# EAGLE design DM542T (EAGLE 9.1.3)
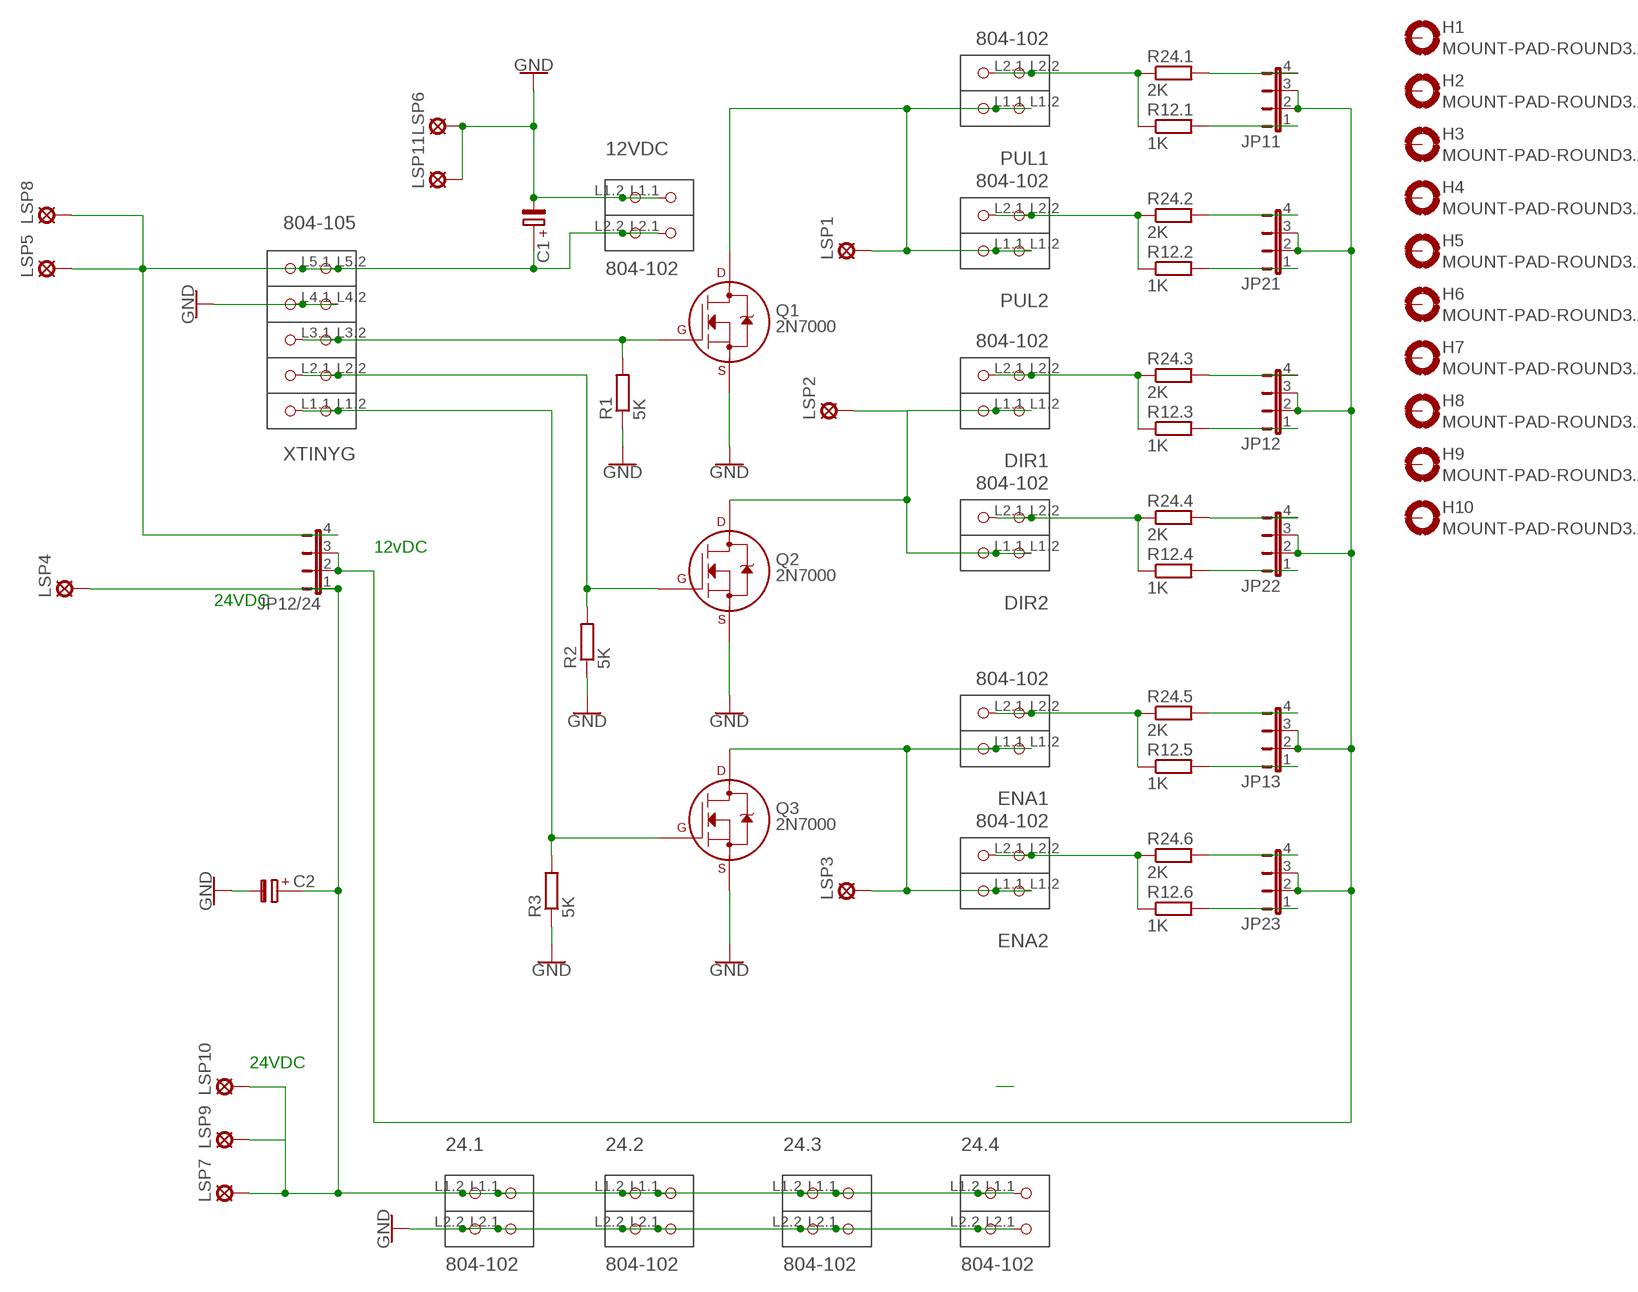
[diagram p0: schematic, sheet 1]

## Parts
12VDC  804-102  [P-804-102]
24.1  804-102  [P-804-102]
24.2  804-102  [P-804-102]
24.3  804-102  [P-804-102]
24.4  804-102  [P-804-102]
C1  C-PR-3,5X10  [E3,5-10]
C2  C-PR-3,5X10  [E3,5-10]
DIR1  804-102  [P-804-102]
DIR2  804-102  [P-804-102]
ENA1  804-102  [P-804-102]
ENA2  804-102  [P-804-102]
H1  MOUNT-PAD-ROUND3.2  [3,2-PAD]
H2  MOUNT-PAD-ROUND3.2  [3,2-PAD]
H3  MOUNT-PAD-ROUND3.2  [3,2-PAD]
H4  MOUNT-PAD-ROUND3.2  [3,2-PAD]
H5  MOUNT-PAD-ROUND3.2  [3,2-PAD]
H6  MOUNT-PAD-ROUND3.2  [3,2-PAD]
H7  MOUNT-PAD-ROUND3.2  [3,2-PAD]
H8  MOUNT-PAD-ROUND3.2  [3,2-PAD]
H9  MOUNT-PAD-ROUND3.2  [3,2-PAD]
H10  MOUNT-PAD-ROUND3.2  [3,2-PAD]
JP11  JP4E  [JP4]
JP12  JP4E  [JP4]
JP12/24  JP4E  [JP4]
JP13  JP4E  [JP4]
JP21  JP4E  [JP4]
JP22  JP4E  [JP4]
JP23  JP4E  [JP4]
LSP1  LSP10  [LSP10]
LSP2  LSP10  [LSP10]
LSP3  LSP10  [LSP10]
LSP4  LSP10  [LSP10]
LSP5  LSP10  [LSP10]
LSP6  LSP10  [LSP10]
LSP7  LSP10  [LSP10]
LSP8  LSP10  [LSP10]
LSP9  LSP10  [LSP10]
LSP10  LSP10  [LSP10]
LSP11  LSP10  [LSP10]
PUL1  804-102  [P-804-102]
PUL2  804-102  [P-804-102]
Q1  2N7000  2N7000_TO92  [TO-92]
Q2  2N7000  2N7000_TO92  [TO-92]
Q3  2N7000  2N7000_TO92  [TO-92]
R1  5K  R-EU_0207/15  [0207/15]
R2  5K  R-EU_0207/15  [0207/15]
R3  5K  R-EU_0207/15  [0207/15]
R12.1  1K  R-EU_0207/15  [0207/15]
R12.2  1K  R-EU_0207/15  [0207/15]
R12.3  1K  R-EU_0207/15  [0207/15]
R12.4  1K  R-EU_0207/15  [0207/15]
R12.5  1K  R-EU_0207/15  [0207/15]
R12.6  1K  R-EU_0207/15  [0207/15]
R24.1  2K  R-EU_0207/15  [0207/15]
R24.2  2K  R-EU_0207/15  [0207/15]
R24.3  2K  R-EU_0207/15  [0207/15]
R24.4  2K  R-EU_0207/15  [0207/15]
R24.5  2K  R-EU_0207/15  [0207/15]
R24.6  2K  R-EU_0207/15  [0207/15]
XTINYG  804-105  [P-804-105]

## Nets
GND: 12VDC.L1.1(P1.1) 12VDC.L1.2(P1.2) 24.1.L2.1(P2.1) 24.1.L2.2(P2.2) 24.2.L2.1(P2.1) 24.2.L2.2(P2.2) 24.3.L2.1(P2.1) 24.3.L2.2(P2.2) 24.4.L2.1(P2.1) 24.4.L2.2(P2.2) C1.- C2.- LSP6.MP LSP11.MP Q1.1(S) Q2.1(S) Q3.1(S) R1.1 R2.1 R3.1 XTINYG.L4.1(P4.1) XTINYG.L4.2(P4.2)
N$1: PUL1.L2.1(P2.1) PUL1.L2.2(P2.2) R12.1.1 R24.1.1
N$2: 12VDC.L2.1(P2.1) 12VDC.L2.2(P2.2) C1.+ JP12/24.4 LSP5.MP LSP8.MP XTINYG.L5.1(P5.1) XTINYG.L5.2(P5.2)
N$4: Q2.2(G) R2.2 XTINYG.L2.1(P2.1) XTINYG.L2.2(P2.2)
N$5: Q3.2(G) R3.2 XTINYG.L1.1(P1.1) XTINYG.L1.2(P1.2)
N$6: DIR1.L1.1(P1.1) DIR1.L1.2(P1.2) DIR2.L1.1(P1.1) DIR2.L1.2(P1.2) LSP2.MP Q2.3(D)
N$7: 24.1.L1.1(P1.1) 24.1.L1.2(P1.2) 24.2.L1.1(P1.1) 24.2.L1.2(P1.2) 24.3.L1.1(P1.1) 24.3.L1.2(P1.2) 24.4.L1.1(P1.1) 24.4.L1.2(P1.2) C2.+ JP12/24.1 LSP4.MP LSP7.MP LSP9.MP LSP10.MP
N$8: JP11.4 R24.1.2
N$9: LSP1.MP PUL1.L1.1(P1.1) PUL1.L1.2(P1.2) PUL2.L1.1(P1.1) PUL2.L1.2(P1.2) Q1.3(D)
N$10: PUL2.L2.1(P2.1) PUL2.L2.2(P2.2) R12.2.1 R24.2.1
N$11: JP11.1 R12.1.2
N$12: JP13.4 R24.5.2
N$13: JP12.1 R12.3.2
N$14: JP22.4 R24.4.2
N$15: JP13.1 R12.5.2
N$16: DIR1.L2.1(P2.1) DIR1.L2.2(P2.2) R12.3.1 R24.3.1
N$17: JP11.2 JP11.3 JP12.2 JP12.3 JP12/24.2 JP12/24.3 JP13.2 JP13.3 JP21.2 JP21.3 JP22.2 JP22.3 JP23.2 JP23.3
N$18: JP12.4 R24.3.2
N$19: ENA1.L2.1(P2.1) ENA1.L2.2(P2.2) R12.5.1 R24.5.1
N$20: JP21.1 R12.2.2
N$21: JP23.4 R24.6.2
N$22: JP23.1 R12.6.2
N$23: ENA2.L2.1(P2.1) ENA2.L2.2(P2.2) R12.6.1 R24.6.1
N$24: JP21.4 R24.2.2
N$25: ENA1.L1.1(P1.1) ENA1.L1.2(P1.2) ENA2.L1.1(P1.1) ENA2.L1.2(P1.2) LSP3.MP Q3.3(D)
N$26: DIR2.L2.1(P2.1) DIR2.L2.2(P2.2) R12.4.1 R24.4.1
N$28: JP22.1 R12.4.2
N$30: Q1.2(G) R1.2 XTINYG.L3.1(P3.1) XTINYG.L3.2(P3.2)
Unconnected: H1.B3,2(MOUNT) H2.B3,2(MOUNT) H3.B3,2(MOUNT) H4.B3,2(MOUNT) H5.B3,2(MOUNT) H6.B3,2(MOUNT) H7.B3,2(MOUNT) H8.B3,2(MOUNT) H9.B3,2(MOUNT) H10.B3,2(MOUNT)

## Notes on the sheet
- 12vDC
- 24VDC
- 24VDC

## Library data of the parts
12VDC 24.1-24.4 DIR1 DIR2 ENA1 ENA2 PUL1 PUL2 = con-wago_804:804-102: Serie 804, 1-Leiter-Klemmenleiste für Leiterplatten 2 Lötstifte/Pol versetzt / Series 804, 1-conductor PCB terminal strip 2 solder pins/pole, staggered Polzahl / Pole No.: 2 Rastermaß / Pitch: 5 - 5 mm Bemessungsspannung / Rated Voltage: 320 V Nennstrom / Nominal Current: 24 A Leiterquerschnitt / Conductor Size: 0.25 - 2.5 mm2 Anschlusstechnik / Connection Technology: CAGE CLAMP® S Lötstiftlänge: / Solder Pin Length: 3.6 mm Leitereinführung (zur Platine) / Conductor entry angle (to PCB): 0 ° Farbe / Color: grau / gray Stand: 01.01.2014. Die jeweils aktuellen Daten zu diesem Artikel finden Sie in unserem Produktkatalog, den Sie unter www.wago.com einsehen können. As of: 01/01/2014. Please find the newest data for this article in our product catalogue, which can be viewed under www.wago.com.
C1 C2 = cap-pan40:C-PR: POLARIZED ELECTROLYTIC/TANTALUM
H1-H10 = holes:MOUNT-PAD-ROUND: MOUNTING PAD, round
JP11 JP12 JP12/24 JP13 JP21-JP23 = jumper:JP4E: JUMPER
LSP1-LSP11 = solpad:LSP10: SOLDER PAD drill 1.0 mm, distributor Buerklin, 12H555
Q1-Q3 = transistors:2N700*: 2N7000, 2N7002, NDS7002A N-channel enhancement mode MOSFET
R1-R3 R12.1-R12.6 R24.1-R24.6 = rcl:R-EU_: RESISTOR, European symbol; SPICEPREFIX: R
XTINYG = con-wago_804:804-105: Serie 804, 1-Leiter-Klemmenleiste für Leiterplatten 2 Lötstifte/Pol versetzt / Series 804, 1-conductor PCB terminal strip 2 solder pins/pole, staggered Polzahl / Pole No.: 5 Rastermaß / Pitch: 5 - 5 mm Bemessungsspannung / Rated Voltage: 320 V Nennstrom / Nominal Current: 24 A Leiterquerschnitt / Conductor Size: 0.25 - 2.5 mm2 Anschlusstechnik / Connection Technology: CAGE CLAMP® S Lötstiftlänge: / Solder Pin Length: 3.6 mm Leitereinführung (zur Platine) / Conductor entry angle (to PCB): 0 ° Farbe / Color: grau / gray Stand: 01.01.2014. Die jeweils aktuellen Daten zu diesem Artikel finden Sie in unserem Produktkatalog, den Sie unter www.wago.com einsehen können. As of: 01/01/2014. Please find the newest data for this article in our product catalogue, which can be viewed under www.wago.com.

## Board
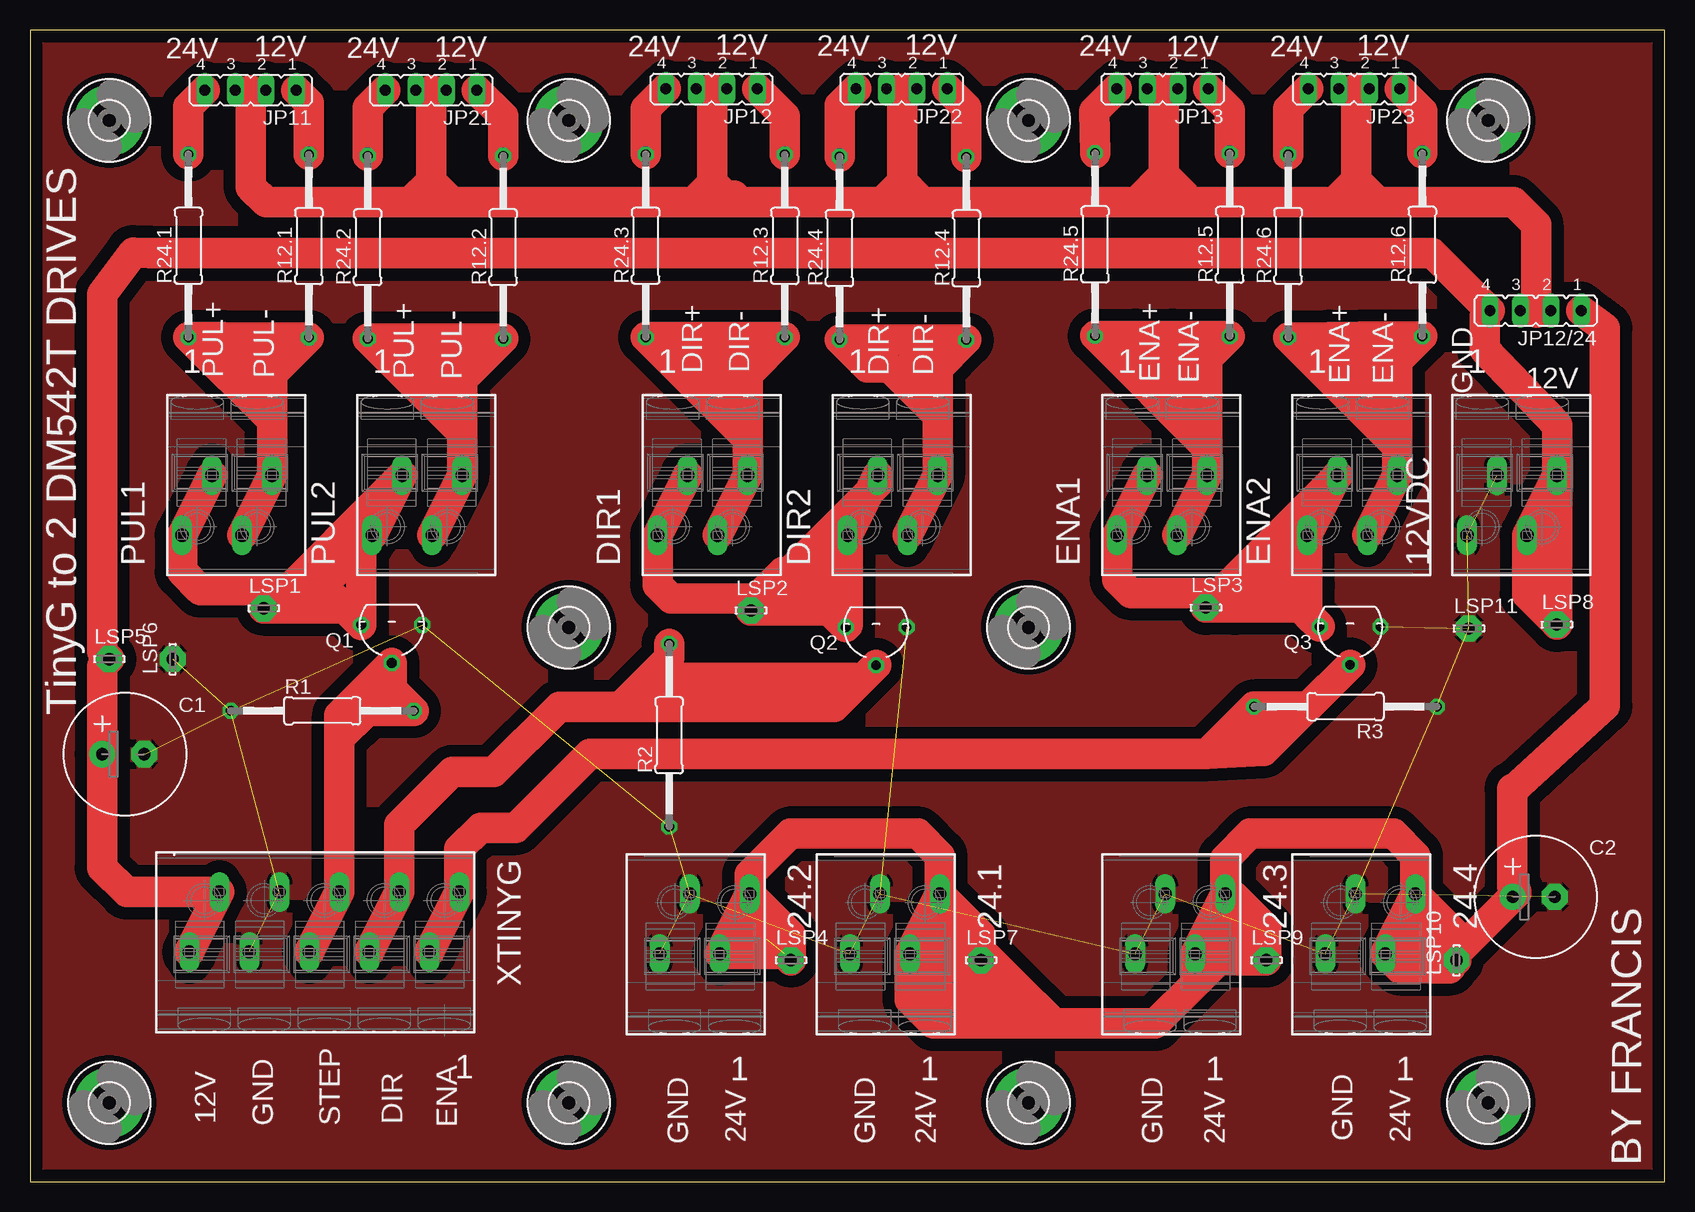
[diagram p1: board, top side]

Size 136.23 x 96.04 mm. Coordinates in mm from the lower left corner, seen from the top.
Outline: 0,0 136.23,0 136.23,96.04 0,96.04 0,0
Copper layers (1*16): Top 0.35mm / dielectric 1.5mm / Bottom 0.35mm
Design rules "default *": minimum track width 0.35mm, minimum drill 0.35mm, track to track 0.35mm, track to pad 0.35mm, pad to pad 0.35mm, via to via 0.35mm, smd to smd 6mil, copper to edge 40mil, drill to drill 0.35mm, minimum pad ring 10mil, minimum via ring 8mil, stop-mask expansion 4mil, vias tented up to drill 0mil, thermal gap 10mil

### Footprints (pad centres in the part's own frame; a part is rotated, then mirrored left to right if it is on the bottom)
P-804-102 = drill 1.1 long: L1.1 0.8,2; L1.2 -4.2,4.5; L2.1 0.8,-3; L2.2 -4.2,-0.5
E3,5-10 = drill 1.016 pad 2.184: + -1.905,0 | drill 1.016 pad 2.184 octagon: - 1.587,0
3,2-PAD = drill 3.2 pad 5.842: B3,2 0,0
JP4 = drill 0.914 long: 1 -3.81,0; 2 -1.27,0; 3 1.27,0; 4 3.81,0
LSP10 = drill 1.016 pad 2.159 octagon: MP 0,0
TO-92 = drill 0.813 octagon: 1 -2.54,0; 2 0,3.175; 3 2.54,0
0207/15 = drill 0.813 octagon: 1 -7.62,0; 2 7.62,0
P-804-105 = drill 1.1 long: L1.1 0.637,9.5; L1.2 -4.363,12; L2.1 0.637,4.5; L2.2 -4.363,7; L3.1 0.637,-0.5; L3.2 -4.363,2; L4.1 0.637,-5.5; L4.2 -4.363,-3; L5.1 0.637,-10.5; L5.2 -4.363,-8

### Placement (x,y rotation side)
12VDC  124.26,58.12 90 top
24.1  71.32,19.81 270 top
24.2  55.47,19.81 270 top
24.3  95.1,19.81 270 top
24.4  110.95,19.81 270 top
C1  7.92,35.66 0 top
C2  125.48,23.77 0 top
DIR1  56.79,58.12 90 top
DIR2  72.64,58.12 90 top
ENA1  95.1,58.12 90 top
ENA2  110.95,58.12 90 top
H1  6.6,88.49 0 top
H2  44.91,88.49 0 top
H3  6.6,6.6 0 top
H4  44.91,6.6 0 top
H5  83.21,6.6 180 top
H6  121.51,6.6 0 top
H7  83.21,88.49 0 top
H8  121.51,88.49 0 top
H9  44.91,46.23 0 top
H10  83.21,46.23 0 top
JP11  18.39,91.03 180 top
JP12  56.79,91.14 180 top
JP12/24  125.48,72.64 180 top
JP13  94.39,91.14 180 top
JP21  33.43,91.03 180 top
JP22  72.64,91.14 180 top
JP23  110.34,91.14 180 top
LSP1  19.48,47.82 0 top
LSP2  60.08,47.64 0 top
LSP3  97.99,47.88 0 top
LSP4  63.4,18.49 0 top
LSP5  6.6,43.59 0 top
LSP6  11.89,43.59 90 top
LSP7  79.25,18.49 0 top
LSP8  127.23,46.47 0 top
LSP9  103.02,18.49 0 top
LSP10  118.87,18.49 90 top
LSP11  119.9,46.14 0 top
PUL1  17.17,58.12 90 top
PUL2  33.02,58.12 90 top
Q1  30.15,46.44 180 top
Q2  70.51,46.26 180 top
Q3  110.01,46.3 180 top
R1  24.36,39.28 0 top
R2  53.27,37.24 90 top
R3  109.63,39.62 180 top
R12.1  23.24,78.03 90 top
R12.2  39.43,77.93 90 top
R12.3  62.9,78.03 90 top
R12.4  78.03,77.83 90 top
R12.5  99.98,78.13 90 top
R12.6  116.03,78.13 90 top
R24.1  13.21,78.04 90 top
R24.2  28.14,77.93 90 top
R24.3  51.31,78.04 90 top
R24.4  67.46,77.85 90 top
R24.5  88.75,78.16 90 top
R24.6  104.85,78.03 90 top
XTINYG  23.77,19.81 270 top

### Tracks (layer width: path | path; a pad name or v marks a point on that pad's centre or on a via)
GND  (21 unrouted)
  pour Top (isolate 1.016): 0,96.42 0,0 136.04,0 136.04,96.42
N$1
  Top 2.54: PUL1.L2.1 PUL1.L2.2 | PUL1.L2.1 20.17,66.4 | 20.17,66.4 20.17,69.34 R12.1.1 | 16.12,70.42 R24.1.1 20.17,63.46 PUL1.L2.1 | 16.12,70.42 R12.1.1 | 16.12,70.42 20.14,66.4 20.17,66.4 | R12.1.1 20.17,67.33 PUL1.L2.1
N$2
  Top 2.54: 12VDC.L2.1 12VDC.L2.2 | 12VDC.L2.1 127.28,63.08 121.22,69.39 121.22,72.19 JP12/24.4 116.87,77.44 9.99,77.44 8.6,77.48 6,74.02 6,44.19 LSP5.MP 6.02,43 C1.+ 6.02,26.2 8.04,24.18 XTINYG.L5.2 XTINYG.L5.1 | 12VDC.L2.1 127.25,46.49 | 127.25,46.49 LSP8.MP 127.23,51.44 12VDC.L2.2 | 12VDC.L2.2 124.75,48.99 127.25,46.49
N$4
  Top 2.54: XTINYG.L2.1 XTINYG.L2.2 30.77,29.76 35.19,34.17 38.66,34.17 44.09,39.6 49.18,39.6 | 69.12,41.69 67.03,39.6 49.18,39.6 | 69.12,41.69 Q2.2 | R2.2 53.27,43.68 51.59,42.01 | 51.59,42.01 49.18,39.6 | 51.59,42.01 66.35,42.01 68.81,42.01 69.12,41.69
N$5
  Top 2.54: XTINYG.L1.1 XTINYG.L1.2 35.77,27.76 37.54,29.53 40.49,29.53 46.65,35.69 98.07,35.69 | 103.35,39.62 106.51,39.62 Q3.2 102.83,35.94 98.07,35.69 | 103.35,39.62 R3.2 99.52,37.13 | 98.07,35.69 99.52,37.13 | 99.52,37.13 100.86,37.13 103.35,39.62
N$6
  Top 2.54: DIR1.L1.1 DIR1.L1.2 52.29,49.77 53.43,48.64 60.52,48.64 | DIR2.L1.2 DIR2.L1.1 70.64,58.2 LSP2.MP | 60.52,48.64 62.74,50.86 63.02,50.58 | LSP2.MP 63.02,50.58 | DIR2.L1.2 61.87,47.64 LSP2.MP | 60.52,48.64 65.59,48.64 | 65.59,48.64 Q2.3 | Q2.3 66.58,47.64 LSP2.MP | DIR2.L1.2 68.14,46.43 Q2.3 | 65.59,48.64 66.69,49.74 66.69,51.15 65.75,50.21 65.44,50.21 64.73,49.5 63.32,49.5 63.32,50.28 63.02,50.58
N$7  (2 unrouted)
  Top 2.54: 24.2.L1.2 24.2.L1.1 62.88,19.01 LSP4.MP 63.4,20.59 24.2.L1.2 | 24.1.L1.2 74.53,21.43 | 74.53,21.43 24.1.L1.1 | 24.3.L1.2 98.59,22 | 98.59,22 24.3.L1.1 | 24.4.L1.2 114.1,21.32 | 114.1,21.32 24.4.L1.1 | LSP10.MP 118.87,20.59 117.7,21.76 | 117.7,21.76 24.4.L1.2 | LSP9.MP 103.02,21.13 100.38,23.77 99.83,23.77 24.3.L1.2 | LSP7.MP 79.25,19.3 | 24.1.L1.2 79.25,20.59 79.25,19.3 | 24.2.L1.2 59.97,25.63 63.4,29.06 73.97,29.06 75.82,27.2 24.1.L1.2 | 24.1.L1.1 73.32,15.17 75.29,13.21 84.53,13.21 | 85.34,13.21 93.78,13.21 97.1,16.53 | 97.1,16.53 24.3.L1.1 | 24.3.L1.2 99.6,26.95 101.7,29.06 113.59,29.06 115.45,27.2 24.4.L1.2 | 60.81,20.31 60.81,23.18 24.2.L1.2 | 24.1.L1.1 78.73,19.01 LSP7.MP | 74.53,21.43 75.92,21.43 76.52,20.83 | 76.69,20.67 76.52,20.83 | 76.52,20.83 76.52,20.96 | 24.3.L1.1 102.5,19.01 LSP9.MP | 98.59,22 98.74,22 100.59,20.14 | LSP10.MP 118.35,19.01 118.35,17.84 118.33,17.82 114.14,17.82 24.4.L1.1 | 114.1,21.32 115.67,21.32 116.73,20.26 | LSP10.MP 118.87,19.07 C2.+ 123.87,24.07 123.87,24.23 123.52,24.58 123.52,32.78 123.7,32.78 131.23,39.67 131.23,71.17 JP12/24.1 | LSP7.MP 84.53,13.21 | 84.53,13.21 85.34,13.21 | 85.34,13.21 81.88,16.66 | 81.88,16.66 79.25,19.3 | 24.1.L1.1 75.41,16.93 75.41,15.46 75.97,14.89 80.85,14.89 78.39,17.36 76.97,17.36 76.83,17.22 77.39,16.66 81.88,16.66 | LSP9.MP 99.06,18.49 97.1,16.53 | 24.4.L1.1 113.57,19.63 115.69,19.63 117.7,21.64 117.7,21.76
N$8
  Top 2.54: JP11.4 13.21,89.66 R24.1.2
N$9
  Top 2.54: PUL1.L1.1 PUL1.L1.2 12.67,50.88 14.2,49.34 21,49.34 | PUL2.L1.2 PUL2.L1.1 19.93,47.82 LSP1.MP | 21,49.34 21.61,49.34 24.71,49.34 Q1.3 | LSP1.MP 21,49.34 | LSP1.MP 22.43,47.82 PUL2.L1.2 | PUL2.L1.2 27.61,53 Q1.3 | Q1.3 26.23,47.82 LSP1.MP
N$10
  Top 2.54: PUL2.L2.1 PUL2.L2.2 | 31.5,70.31 R24.2.1 36.02,62.43 PUL2.L2.1 | 31.5,70.31 34.54,70.31 | 34.54,70.31 R12.2.1 | PUL2.L2.1 36.02,65.9 | 36.02,65.9 36.02,68.83 | 36.02,68.83 36.02,69.34 R12.2.1 | 31.5,70.31 35.91,65.9 36.02,65.9 | 34.54,70.31 36.02,68.83 | R12.2.1 36.02,66.89 PUL2.L2.1
N$11
  Top 2.54: JP11.1 23.24,89.99 R12.1.2
N$12
  Top 2.54: R24.5.2 88.69,89.25 JP13.4
N$13
  Top 2.54: JP12.1 62.9,88.84 R12.3.2
N$14
  Top 2.54: R24.4.2 67.46,89.76 JP22.4
N$15
  Top 2.54: JP13.1 99.98,89.36 R12.5.2
N$16
  Top 2.54: DIR1.L2.1 DIR1.L2.2 | 54.53,70.42 R24.3.1 59.79,61.94 DIR1.L2.1 | 54.53,70.42 58.13,70.42 | 58.13,70.42 R12.3.1 | DIR1.L2.1 59.79,65.16 | 59.79,65.16 59.79,68.06 | 59.79,68.06 59.79,69.34 R12.3.1 | 54.53,70.42 59.79,65.16 | 58.13,70.42 58.34,70.21 58.34,69.51 59.79,68.06 | R12.3.1 59.79,67.3 DIR1.L2.1
N$17
  Top 1.27: JP22.3 72.68,91.14 JP22.2 | JP13.3 94.5,91.14 JP13.2 | JP23.3 110.53,91.14 JP23.2 | JP12.3 56.85,91.14 JP12.2 | JP11.3 18.41,91.03 JP11.2 | JP21.3 33.43,91.03 JP21.2 | 125.57,72.47 125.74,72.64 JP12/24.2 JP12/24.3
  Top 2.54: 18.41,91.03 18.41,82.95 19.69,81.68 31.66,81.68 | 31.66,81.68 33.02,81.68 | 33.02,81.68 35.06,81.68 | 35.06,81.68 55.28,81.68 | 55.28,81.68 56.91,81.68 | 56.91,81.68 59.24,81.68 | 59.24,81.68 70.97,81.68 | 70.97,81.68 72.68,81.68 | 72.68,81.68 74.03,81.68 | 74.03,81.68 92.22,81.68 | 92.22,81.68 94.16,81.68 | 94.16,81.68 96.16,81.68 | 96.16,81.68 108.7,81.68 | 108.7,81.68 110.83,81.68 | 110.83,81.68 112.37,81.68 | 112.37,81.68 123.64,81.68 125.51,79.81 125.51,72.53 125.57,72.47 | 110.53,91.14 110.53,83.51 | 110.53,83.51 110.53,81.97 110.83,81.68 | 94.5,91.14 94.5,84 | 94.5,84 94.5,82.02 94.16,81.68 | 72.68,91.14 72.68,83.38 | 72.68,83.38 72.68,81.68 | 56.85,91.14 56.85,83.34 | 56.85,83.25 56.85,81.73 56.91,81.68 | 33.43,91.03 33.43,83.44 | 33.43,83.44 33.43,82.09 33.02,81.68 | 33.43,83.44 31.66,81.68 | 33.43,83.44 35.06,81.81 35.06,81.68 | 56.85,83.34 56.85,83.25 | 56.85,83.25 55.28,81.68 | 56.85,83.34 57.98,82.21 58.7,82.21 59.24,81.68 | 72.68,83.38 70.97,81.68 | 72.68,83.38 74.03,82.03 74.03,81.68 | 94.5,84 92.22,81.72 92.22,81.68 | 94.5,84 96.16,82.33 96.16,81.68 | 110.53,83.51 108.7,81.68 | 110.53,83.51 112.37,81.68
N$18
  Top 2.54: R24.3.2 51.31,89.46 JP12.4
N$19
  Top 2.54: ENA1.L2.1 ENA1.L2.2 | 92.11,70.53 R24.5.1 98.1,61.2 ENA1.L2.1 | 92.11,70.53 95.22,70.52 | 95.22,70.52 R12.5.1 | R12.5.1 98.1,69.34 98.1,67.95 | 98.1,67.95 98.1,64.77 | 98.1,64.77 ENA1.L2.1 | 92.11,70.53 97.87,64.77 98.1,64.77 | 95.22,70.52 97.79,67.95 98.1,67.95 | R12.5.1 98.1,68.63 ENA1.L2.1 | 91.98,70.28 97.74,64.52
N$20
  Top 2.54: JP21.1 39.43,88.84 R12.2.2
N$21
  Top 2.54: R24.6.2 104.85,89.46 JP23.4
N$22
  Top 2.54: JP23.1 116.03,89.25 R12.6.2
N$23
  Top 2.54: ENA2.L2.1 ENA2.L2.2 | 108.28,70.44 R24.6.1 108.08,67.18 | 108.28,70.44 110.9,70.46 | 110.9,70.46 R12.6.1 | R12.6.1 113.95,69.34 113.95,65.13 | 113.95,65.13 ENA2.L2.1 | 108.08,67.18 113.95,61.31 ENA2.L2.1 | 108.28,70.44 113.59,65.13 113.95,65.13 | 110.9,70.46 113.02,68.35 113.02,68.09 108.99,68.09 108.08,67.18 | R12.6.1 113.95,68.43 ENA2.L2.1
N$24
  Top 2.54: R24.2.2 28.14,89.56 JP21.4
N$25
  Top 2.54: ENA2.L1.2 ENA2.L1.1 108.95,58.84 LSP3.MP | ENA1.L1.1 ENA1.L1.2 90.6,50.23 91.72,49.11 99.21,49.11 | 99.21,49.11 99.6,49.11 104.66,49.11 Q3.3 | Q3.3 106.45,47.32 106.45,49.74 | 106.45,49.74 ENA2.L1.2 | ENA2.L1.2 100.42,47.88 LSP3.MP | 99.21,49.11 LSP3.MP | LSP3.MP 105.88,47.88 Q3.3 | LSP3.MP 99.84,49.74 106.45,49.74
N$26
  Top 2.54: DIR2.L2.1 DIR2.L2.2 | 75.64,64.14 75.64,67.11 75.64,69.34 R12.4.1 | R12.4.1 73.67,70.22 | 73.67,70.22 71.06,70.22 70.7,70.22 R24.4.1 69.8,67.89 71.63,67.89 75.64,63.87 DIR2.L2.1 | 75.64,64.14 73.67,66.11 73.67,70.22 | R12.4.1 75.64,67.82 DIR2.L2.1 | DIR2.L2.1 75.64,64.14
N$28
  Top 2.54: R12.4.2 78.03,89.56 JP22.1
N$30
  Top 2.54: XTINYG.L3.1 XTINYG.L3.2 25.77,36.96 | 25.77,36.96 25.77,38.9 26.5,39.62 | R1.2 26.5,39.62 | 26.5,39.62 Q1.2 30.15,41.11 R1.2 | R1.2 28.1,39.28 25.77,36.96

### Text on the board
tNames: 12V | 12V | 24V | 12V | 24V | 12V | 24V | 12V | 24V | 12V | 24V | 24V | 12V | PUL+ | PUL- | PUL+ | PUL- | DIR+ | DIR- | DIR+ | DIR- | ENA+ | ENA- | ENA+ | ENA- | GND | TinyG to 2 DM542T DRIVES | 12V | GND | STEP | DIR | ENA | GND | 24V | GND | 24V | GND | 24V | GND | 24V | BY FRANCIS